# Altium schematic sheet UPCNSL-ABS-EPS_test-v1.0.SchDoc
size A3
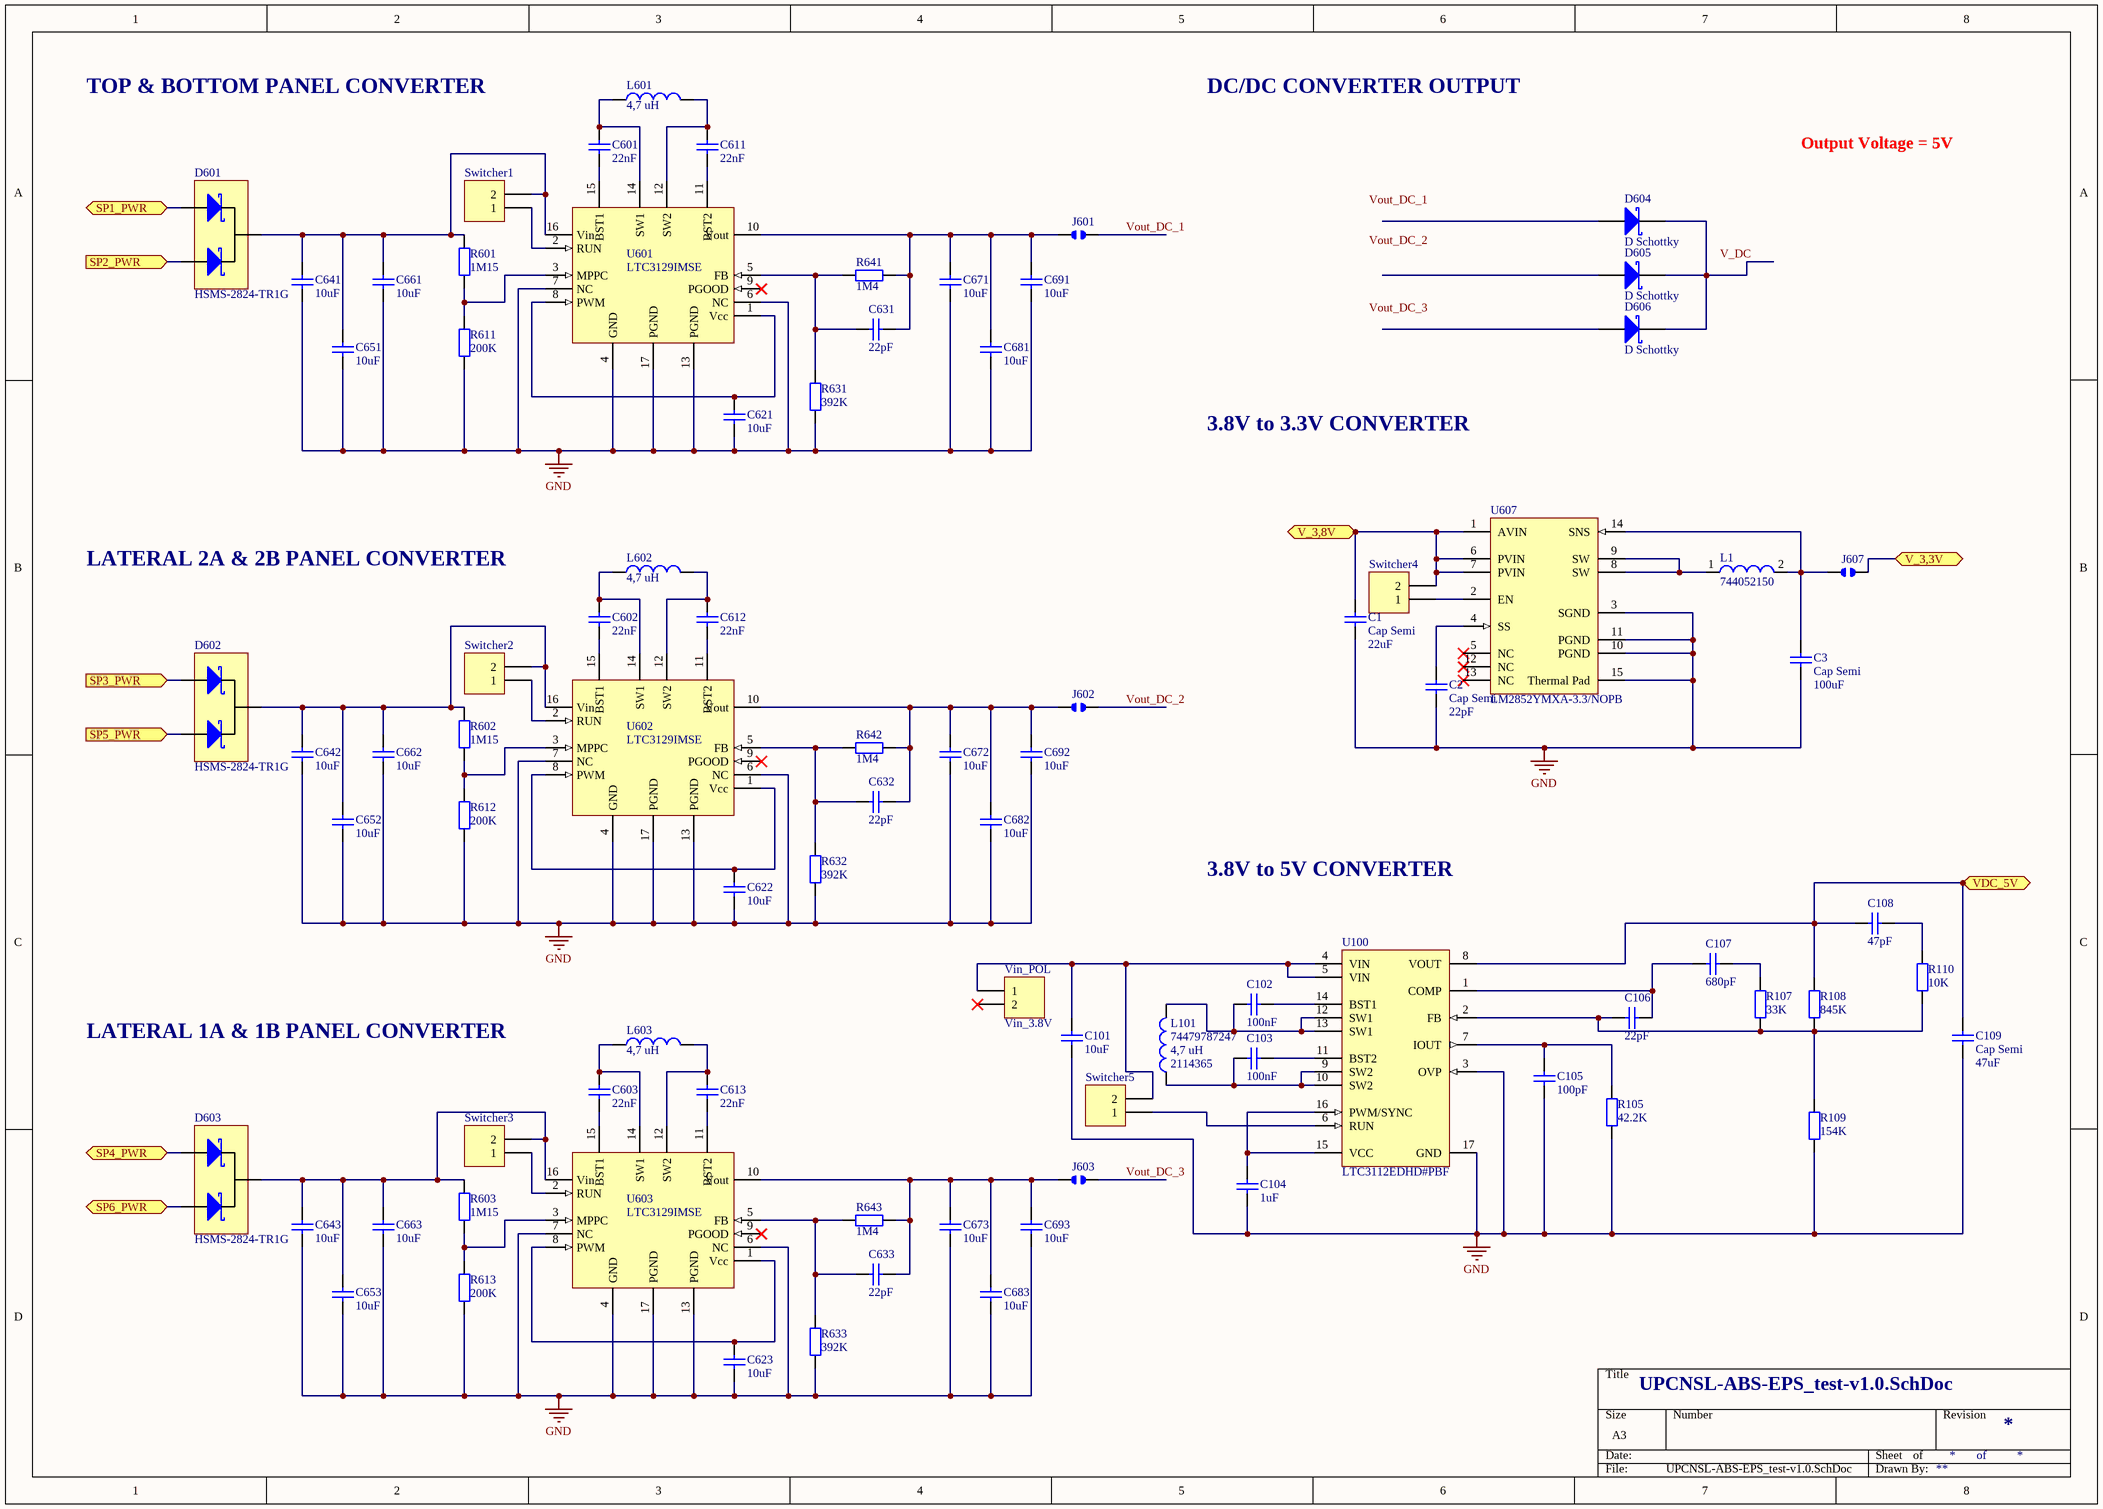
[diagram p0: UPCNSL-ABS-EPS_test-v1.0.SchDoc]

## Parts
C1  Cap Semi  value 22uF  [C1206]
C2  Cap Semi  value 22pF  [1608[0603]]
C3  Cap Semi  value 100uF  [C1206]
C101  value 10uF  [CAP0603]  (hidden comment: CAP0603)
C102  value 100nF  [CAP0603]  (hidden comment: CAP0603)
C103  value 100nF  [CAP0603]  (hidden comment: CAP0603)
C104  value 1uF  [CAP0603]  (hidden comment: CAP0603)
C105  value 100pF  [CAP0603]  (hidden comment: CAP0603)
C106  value 22pF  [CAP0603]  (hidden comment: CAP0603)
C107  value 680pF  [CAP0603]  (hidden comment: CAP0603)
C108  value 47pF  [CAP0603]  (hidden comment: CAP0603)
C109  Cap Semi  value 47uF  [C1206]
C601  value 22nF  [CAP0603]  (hidden comment: CAP0603)
C602  value 22nF  [CAP0603]  (hidden comment: CAP0603)
C603  value 22nF  [CAP0603]  (hidden comment: CAP0603)
C611  value 22nF  [CAP0603]  (hidden comment: CAP0603)
C612  value 22nF  [CAP0603]  (hidden comment: CAP0603)
C613  value 22nF  [CAP0603]  (hidden comment: CAP0603)
C621  value 10uF  [CAP0603]  (hidden comment: CAP0603)
C622  value 10uF  [CAP0603]  (hidden comment: CAP0603)
C623  value 10uF  [CAP0603]  (hidden comment: CAP0603)
C631  value 22pF  [CAP0603]  (hidden comment: CAP0603)
C632  value 22pF  [CAP0603]  (hidden comment: CAP0603)
C633  value 22pF  [CAP0603]  (hidden comment: CAP0603)
C641  value 10uF  [CAP0603]  (hidden comment: CAP0603)
C642  value 10uF  [CAP0603]  (hidden comment: CAP0603)
C643  value 10uF  [CAP0603]  (hidden comment: CAP0603)
C651  value 10uF  [CAP0603]  (hidden comment: CAP0603)
C652  value 10uF  [CAP0603]  (hidden comment: CAP0603)
C653  value 10uF  [CAP0603]  (hidden comment: CAP0603)
C661  value 10uF  [CAP0603]  (hidden comment: CAP0603)
C662  value 10uF  [CAP0603]  (hidden comment: CAP0603)
C663  value 10uF  [CAP0603]  (hidden comment: CAP0603)
C671  value 10uF  [CAP0603]  (hidden comment: CAP0603)
C672  value 10uF  [CAP0603]  (hidden comment: CAP0603)
C673  value 10uF  [CAP0603]  (hidden comment: CAP0603)
C681  value 10uF  [CAP0603]  (hidden comment: CAP0603)
C682  value 10uF  [CAP0603]  (hidden comment: CAP0603)
C683  value 10uF  [CAP0603]  (hidden comment: CAP0603)
C691  value 10uF  [CAP0603]  (hidden comment: CAP0603)
C692  value 10uF  [CAP0603]  (hidden comment: CAP0603)
C693  value 10uF  [CAP0603]  (hidden comment: CAP0603)
D601  HSMS-2824-TR1G  [SOT23-3]
D602  HSMS-2824-TR1G  [SOT23-3]
D603  HSMS-2824-TR1G  [SOT23-3]
D604  D Schottky  [SMB]
D605  D Schottky  [SMB]
D606  D Schottky  [SMB]
J601  Jumper_Solderpad  [JUMPER_SOLDERPAD]  (value not drawn)
J602  Jumper_Solderpad  [JUMPER_SOLDERPAD]  (value not drawn)
J603  Jumper_Solderpad  [JUMPER_SOLDERPAD]  (value not drawn)
J607  (no value)  [JUMPER_SOLDERPAD]
L1  744052150  [WE-TPC-5818-L]
L101  74479787247  value 4,7 uH  Supplier Part Number 1: 2114365  [74479787247]
L601  value 4,7 uH  [74479787247]
L602  value 4,7 uH  [74479787247]
L603  value 4,7 uH  [74479787247]
R105  value 42.2K  [RES0603]  (hidden comment: RES0603)
R107  value 33K  [RES0603]  (hidden comment: RES0603)
R108  value 845K  [RES0603]  (hidden comment: RES0603)
R109  value 154K  [RES0603]  (hidden comment: RES0603)
R110  value 10K  [RES0603]  (hidden comment: RES0603)
R601  value 1M15  [RES0603]  (hidden comment: RES0603)
R602  value 1M15  [RES0603]  (hidden comment: RES0603)
R603  value 1M15  [RES0603]  (hidden comment: RES0603)
R611  value 200K  [RES0603]  (hidden comment: RES0603)
R612  value 200K  [RES0603]  (hidden comment: RES0603)
R613  value 200K  [RES0603]  (hidden comment: RES0603)
R631  value 392K  [RES0603]  (hidden comment: RES0603)
R632  value 392K  [RES0603]  (hidden comment: RES0603)
R633  value 392K  [RES0603]  (hidden comment: RES0603)
R641  value 1M4  [RES0603]  (hidden comment: RES0603)
R642  value 1M4  [RES0603]  (hidden comment: RES0603)
R643  value 1M4  [RES0603]  (hidden comment: RES0603)
Switcher1  (no value)  [HDR1X2]
Switcher2  (no value)  [HDR1X2]
Switcher3  (no value)  [HDR1X2]
Switcher4  (no value)  [HDR1X2]
Switcher5  (no value)  [HDR1X2]
U100  LTC3112EDHD#PBF  [LT-DHD-16_V]
U601  LTC3129IMSE  [MSOP-16]
U602  LTC3129IMSE  [MSOP-16]
U603  LTC3129IMSE  [MSOP-16]
U607  LM2852YMXA-3.3/NOPB  [MXA14A_L]
Vin_POL  Vin_3.8V  [HDR1X2]

## Ports
SP1_PWR, SP2_PWR (in), SP3_PWR (in), SP4_PWR, SP5_PWR (in), SP6_PWR, V_3,3V, V_3,8V, VDC_5V

## Nets
GND: C1.2 C2.2 C3.2 C101.1 C104.1 C105.1 C109.2 C621.1 C622.1 C623.1 C641.1 C642.1 C643.1 C651.1 C652.1 C653.1 C661.1 C662.1 C663.1 C671.1 C672.1 C673.1 C681.1 C682.1 C683.1 C691.1 C692.1 C693.1 R105.1 R109.1 R611.1 R612.1 R613.1 R631.1 R632.1 R633.1 U100.3(OVP) U100.17(GND) U601.4(GND) U601.6(NC) U601.7(NC) U601.13(PGND) U601.17(PGND) U602.4(GND) U602.6(NC) U602.7(NC) U602.13(PGND) U602.17(PGND) U603.4(GND) U603.6(NC) U603.7(NC) U603.13(PGND) U603.17(PGND) U607.3(SGND) U607.10(PGND) U607.11(PGND) U607.15(Thermal_Pad)
SP1_PWR: D601.1(A1) ; port SP1_PWR
SP2_PWR: D601.2(A2) ; port SP2_PWR
SP3_PWR: D602.1(A1) ; port SP3_PWR
SP4_PWR: D603.1(A1) ; port SP4_PWR
SP5_PWR: D602.2(A2) ; port SP5_PWR
SP6_PWR: D603.2(A2) ; port SP6_PWR
V_3,3V: J607.2 ; port V_3,3V
V_3,8V: C1.1 Switcher4.2 U607.1(AVIN) U607.6(PVIN) U607.7(PVIN) ; port V_3,8V
VDC_5V: C108.1 C109.1 R108.2 U100.8(VOUT) ; port VDC_5V
Vout_DC_1: J601.2
Vout_DC_2: J602.2
Vout_DC_3: J603.2
NetC2_1: C2.1 U607.4(SS)
NetC3_1: C3.1 J607.1 L1.2 U607.14(SNS)
NetC101_2: C101.2 Switcher5.2 U100.4(VIN) U100.5(VIN) Vin_POL.1
NetC102_1: C102.1 U100.14(BST1)
NetC102_2: C102.2 L101.2 U100.12(SW1) U100.13(SW1)
NetC103_1: C103.1 U100.11(BST2)
NetC103_2: C103.2 L101.1 U100.9(SW2) U100.10(SW2)
NetC104_2: C104.2 U100.15(VCC) U100.16(PWM/SYNC)
NetC105_2: C105.2 R105.2 U100.7(IOUT)
NetC106_1: C106.1 R107.1 R108.1 R109.2 R110.1 U100.2(FB)
NetC106_2: C106.2 C107.1 U100.1(COMP)
NetC107_2: C107.2 R107.2
NetC108_2: C108.2 R110.2
NetC601_1: C601.1 U601.15(BST1)
NetC601_2: C601.2 L601.1 U601.14(SW1)
NetC602_1: C602.1 U602.15(BST1)
NetC602_2: C602.2 L602.1 U602.14(SW1)
NetC603_1: C603.1 U603.15(BST1)
NetC603_2: C603.2 L603.1 U603.14(SW1)
NetC611_1: C611.1 U601.11(BST2)
NetC611_2: C611.2 L601.2 U601.12(SW2)
NetC612_1: C612.1 U602.11(BST2)
NetC612_2: C612.2 L602.2 U602.12(SW2)
NetC613_1: C613.1 U603.11(BST2)
NetC613_2: C613.2 L603.2 U603.12(SW2)
NetC621_2: C621.2 U601.1(Vcc) U601.8(PWM)
NetC622_2: C622.2 U602.1(Vcc) U602.8(PWM)
NetC623_2: C623.2 U603.1(Vcc) U603.8(PWM)
NetC631_1: C631.1 C671.2 C681.2 C691.2 J601.1 R641.1 U601.10(Vout)
NetC631_2: C631.2 R631.2 R641.2 U601.5(FB)
NetC632_1: C632.1 C672.2 C682.2 C692.2 J602.1 R642.1 U602.10(Vout)
NetC632_2: C632.2 R632.2 R642.2 U602.5(FB)
NetC633_1: C633.1 C673.2 C683.2 C693.2 J603.1 R643.1 U603.10(Vout)
NetC633_2: C633.2 R633.2 R643.2 U603.5(FB)
NetC641_2: C641.2 C651.2 C661.2 D601.3(K) R601.2 Switcher1.2 U601.16(Vin)
NetC642_2: C642.2 C652.2 C662.2 D602.3(K) R602.2 Switcher2.2 U602.16(Vin)
NetC643_2: C643.2 C653.2 C663.2 D603.3(K) R603.2 Switcher3.2 U603.16(Vin)
NetD604_2: D604.2(K) D605.2(K) D606.2(K)
NetL1_1: L1.1 U607.8(SW) U607.9(SW)
NetR601_1: R601.1 R611.2 U601.3(MPPC)
NetR602_1: R602.1 R612.2 U602.3(MPPC)
NetR603_1: R603.1 R613.2 U603.3(MPPC)
NetSwitcher1_1: Switcher1.1 U601.2(RUN)
NetSwitcher2_1: Switcher2.1 U602.2(RUN)
NetSwitcher3_1: Switcher3.1 U603.2(RUN)
NetSwitcher4_1: Switcher4.1 U607.2(EN)
NetSwitcher5_1: Switcher5.1 U100.6(RUN)

Not connected (* = marked no-connect by the designer): D604 1(A); D605 1(A); D606 1(A); U601 9(PGOOD)*; U602 9(PGOOD)*; U603 9(PGOOD)*; U607 5(NC)* 12(NC)* 13(NC)*; Vin_POL 2*

## Notes on the sheet
- TOP & BOTTOM PANEL CONVERTER
- DC/DC CONVERTER OUTPUT
- Output Voltage = 5V
- 3.8V to 3.3V CONVERTER
- LATERAL 2A & 2B PANEL CONVERTER
- 3.8V to 5V CONVERTER
- LATERAL 1A & 1B PANEL CONVERTER
- of
- **
- Labels drawn without touching a wire or pin: V_DC, Vout_DC_1, Vout_DC_2, Vout_DC_3

## Library data of the parts
C1-C3 C109 = Cap Semi: Capacitor (Semiconductor SIM Model); Published: 8-Jun-2000; LatestRevisionDate: 29-May-2009; LatestRevisionNote: IPC-7351 Footprint Added.; PackageReference: C1206; Publisher: Altium Limited; PackageDescription: Chip Capacitor
C101-C108 C601-C603 C611-C613 C621-C623 C631-C633 C641-C643 C651-C653 C661-C663 C671-C673 C681-C683 C691-C693 = CAP0603: Capacitor
D601-D603 = HSMS-2824-TR1G: DIODE, RF, SCHOTTKY, DUAL, SOT-23; Supplier 1: Mouser; Supplier Part Number 1: 630-HSMS-2824-TR2G
D604-D606 = D Schottky: Schottky Diode; Published: 8-Jun-2000; LatestRevisionDate: 17-Jul-2002; LatestRevisionNote: Re-released for DXP Platform.; PackageReference: SMB; Publisher: Altium Limited; PackageDescription: DO-214-AA/SMB; 2 C-Bend Leads; Body 5.3 x 3.6 mm, inc. leads (LxW); Code_JEDEC: DO-214-AA
J607 = Jumper_Solderpad
L1 = 744052150: SMD Shielded Tiny Power Inductor WE-TPC, L = 15.0 µH; Inductance: 15.0 µH; DatasheetVersion: ver 7, Aug-2010; PackageReference: WE-TPC-5818-L; PackageDescription: SMD Inductor, 2-Leads, Body 5.8 x 5.8 mm; PartNumber: 744052150; ComponentLink1Description: Manufacturer URL; ComponentLink1URL: http://www.we-online.com; ComponentLink2Description: Datasheet; ComponentLink2URL: http://www.we-online.de/katalog/media/pdf/744052150.pdf
L101 L601-L603 = 74479787247: INDUCTOR, 4.7UH, 1.25A, 40MHZ; DC Resistance: 0.11 Ohm; Supplier 1: Farnell
  L601-L603: Supplier Part Number 1: 2114365
R105 R107-R110 R601-R603 R611-R613 R631-R633 R641-R643 = RES0603: Resistor
Switcher1-Switcher5 Vin_POL = Header 2: Header, 2-Pin; LatestRevisionDate: 17-Jul-2002; LatestRevisionNote: Re-released for DXP Platform.; Publisher: Altium Limited
U100 = LTC3112EDHD#PBF: 2.5 A Synchronous Buck-Boost DC/DC Converter, 16-pin SON (DHD-16), -40 to 125 degC, Pb-Free; Manufacturer: Linear Technology; Frequency Sync Range: 300kHz - 1.5MHz; Number of Outputs: 1; DatasheetVersion: Rev. A; PackageVersion: Jun-10; PackageReference: DHD-16; PackageDescription: 16-Pin Plastic DFN, Body 5 x 4 mm, Pitch 0.5 mm; Supplier 1: Digi-Key; Supplier Part Number 1: LTC3112EDHD#PBF-ND; Supplier 2: Newark; Supplier Part Number 2: 59T5585; RoHS: TRUE; Mounting Technology: Surface Mount; Code_JEDEC: MO-229; PartNumber: LTC3112EDHD#PBF; ComponentLink1Description: Manufacturer URL; ComponentLink1URL: http://www.linear.com/; ComponentLink2Description: Datasheet; ComponentLink2URL: http://cds.linear.com/docs/en/datasheet/3112fa.pdf; ComponentLink3Description: Package Specification; ComponentLink3URL: http://cds.linear.com/docs/en/packaging/DFN_16_05-08-1707.pdf
U601-U603 = LTC3129: 15V, 200mA Synchronous Buck-Boost DC/DC Converter with 1.3µA Quiescent Current; Supplier 1: Digi-Key; Supplier Part Number 1: LTC3129IMSE#PBF-ND
U607 = LM2852YMXA-3.3/NOPB: 2A 500/1500kHz Synchronous SIMPLE SWITCHER® Buck Regulator, 14-pin TSSOP-EP, Pb-Free; Manufacturer: National Semiconductor; PackageTopMarking: NSUZXYTT*2852Y*-3.3; PowerWise: Y; DatasheetVersion: Oct-2006; PackageVersion: revA, Feb-2003; PackageReference: MXA14A; PackageDescription: Molded TSSOP, JEDEC, Exposed Pad, 5.0 x 4.4 x 0.9mm Body, 14 Lead, 0.65mm Pitch; PartNumber: LM2852YMXA-3.3/NOPB; RoHS: Y; PinCount: 14; CompType: Switcher; High-Reliability: Y; Code_JEDEC: MO-153-ABT-1; ComponentLink1Description: Manufacturer URL; ComponentLink1URL: http://www.national.com/; ComponentLink2Description: LM2852 Datasheet; ComponentLink2URL: http://www.national.com/ds/LM/LM2852.pdf; ComponentLink3Description: LM2852 Web Page; ComponentLink3URL: http://www.national.com/pf/LM/LM2852.html; ComponentLink4Description: MXA14A Package Page; ComponentLink4URL: http://www.national.com/packaging/folders/mxa14a.html